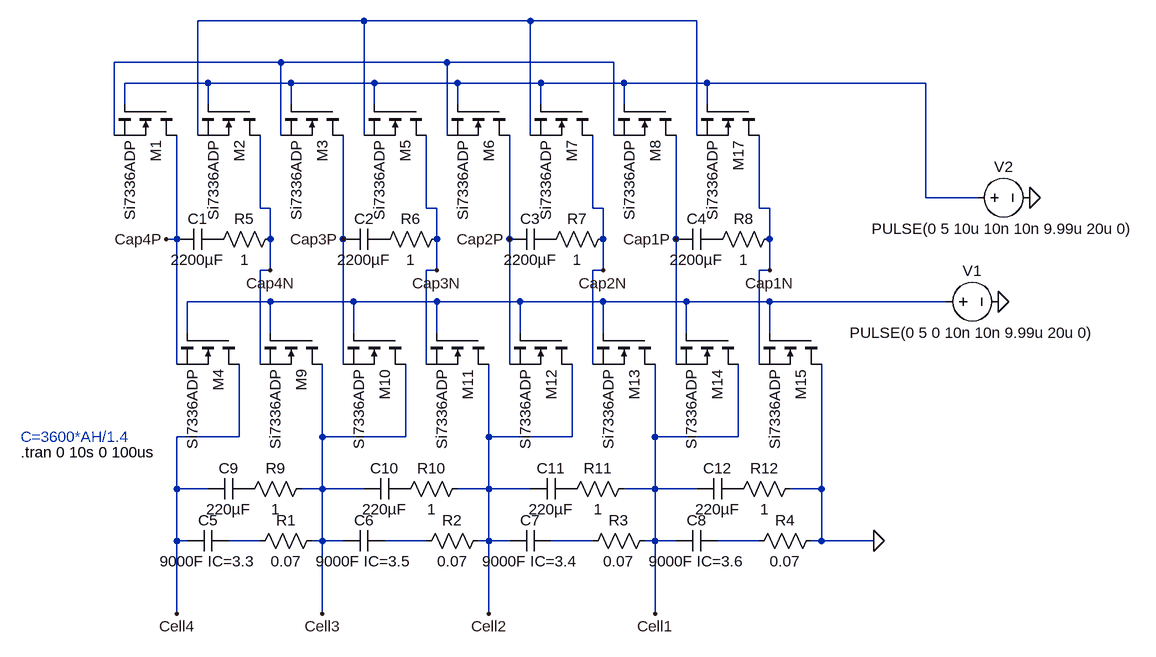
[diagram p0: schematic BMS.asc]
BMS.asc, the LTspice schematic file:
Version 4
SHEET 1 2364 904
WIRE 544 -112 288 -112
WIRE 800 -112 544 -112
WIRE 1056 -112 800 -112
WIRE 416 -48 160 -48
WIRE 672 -48 416 -48
WIRE 928 -48 672 -48
WIRE 304 -16 176 -16
WIRE 432 -16 304 -16
WIRE 560 -16 432 -16
WIRE 688 -16 560 -16
WIRE 816 -16 688 -16
WIRE 944 -16 816 -16
WIRE 1072 -16 944 -16
WIRE 1408 -16 1072 -16
WIRE 176 16 176 -16
WIRE 304 16 304 -16
WIRE 432 16 432 -16
WIRE 560 16 560 -16
WIRE 688 16 688 -16
WIRE 816 16 816 -16
WIRE 944 16 944 -16
WIRE 1072 16 1072 -16
WIRE 160 64 160 -48
WIRE 288 64 288 -112
WIRE 416 64 416 -48
WIRE 544 64 544 -112
WIRE 672 64 672 -48
WIRE 800 64 800 -112
WIRE 928 64 928 -48
WIRE 1056 64 1056 -112
WIRE 1408 160 1408 -16
WIRE 1488 160 1408 160
WIRE 384 176 384 64
WIRE 400 176 384 176
WIRE 640 176 640 64
WIRE 656 176 640 176
WIRE 896 176 896 64
WIRE 912 176 896 176
WIRE 1152 176 1152 64
WIRE 1168 176 1152 176
WIRE 256 224 256 64
WIRE 256 224 240 224
WIRE 400 224 400 176
WIRE 512 224 512 64
WIRE 656 224 656 176
WIRE 768 224 768 64
WIRE 912 224 912 176
WIRE 1024 224 1024 64
WIRE 1168 224 1168 176
WIRE 400 272 400 224
WIRE 400 272 384 272
WIRE 656 272 656 224
WIRE 656 272 640 272
WIRE 912 272 912 224
WIRE 912 272 896 272
WIRE 1168 272 1168 224
WIRE 1168 272 1152 272
WIRE 400 320 272 320
WIRE 528 320 400 320
WIRE 656 320 528 320
WIRE 784 320 656 320
WIRE 912 320 784 320
WIRE 1040 320 912 320
WIRE 1168 320 1040 320
WIRE 1440 320 1168 320
WIRE 272 368 272 320
WIRE 400 368 400 320
WIRE 528 368 528 320
WIRE 656 368 656 320
WIRE 784 368 784 320
WIRE 912 368 912 320
WIRE 1040 368 1040 320
WIRE 1168 368 1168 320
WIRE 256 416 256 224
WIRE 384 416 384 272
WIRE 512 416 512 224
WIRE 640 416 640 272
WIRE 768 416 768 224
WIRE 896 416 896 272
WIRE 1024 416 1024 224
WIRE 1152 416 1152 272
WIRE 352 528 352 416
WIRE 352 528 256 528
WIRE 480 528 480 416
WIRE 608 528 608 416
WIRE 608 528 480 528
WIRE 736 528 736 416
WIRE 864 528 864 416
WIRE 864 528 736 528
WIRE 992 528 992 416
WIRE 1120 528 1120 416
WIRE 1120 528 992 528
WIRE 256 608 256 528
WIRE 304 608 256 608
WIRE 480 608 480 528
WIRE 480 608 448 608
WIRE 544 608 480 608
WIRE 736 608 736 528
WIRE 736 608 688 608
WIRE 800 608 736 608
WIRE 992 608 992 528
WIRE 992 608 944 608
WIRE 1056 608 992 608
WIRE 1248 608 1248 416
WIRE 1248 608 1200 608
WIRE 256 688 256 608
WIRE 272 688 256 688
WIRE 384 688 336 688
WIRE 480 688 480 608
WIRE 480 688 464 688
WIRE 512 688 480 688
WIRE 640 688 576 688
WIRE 736 688 736 608
WIRE 736 688 720 688
WIRE 768 688 736 688
WIRE 896 688 832 688
WIRE 992 688 992 608
WIRE 992 688 976 688
WIRE 1024 688 992 688
WIRE 1152 688 1088 688
WIRE 1248 688 1248 608
WIRE 1248 688 1232 688
WIRE 1328 688 1248 688
WIRE 256 800 256 688
WIRE 480 800 480 688
WIRE 736 800 736 688
WIRE 992 800 992 688
FLAG 1568 160 0
FLAG 1520 320 0
FLAG 1328 688 0
FLAG 256 800 Cell4
FLAG 480 800 Cell3
FLAG 736 800 Cell2
FLAG 992 800 Cell1
FLAG 240 224 Cap4P
FLAG 400 272 Cap4N
FLAG 512 224 Cap3P
FLAG 656 272 Cap3N
FLAG 768 224 Cap2P
FLAG 1024 224 Cap1P
FLAG 912 272 Cap2N
FLAG 1168 272 Cap1N
SYMBOL nmos 256 16 R90
SYMATTR InstName M1
SYMATTR Value Si7336ADP
SYMBOL nmos 384 16 R90
SYMATTR InstName M2
SYMATTR Value Si7336ADP
SYMBOL nmos 512 16 R90
SYMATTR InstName M3
SYMATTR Value Si7336ADP
SYMBOL cap 256 208 M90
WINDOW 0 0 32 VBottom 2
WINDOW 3 32 32 VTop 2
SYMATTR InstName C1
SYMATTR Value 2200µF
SYMBOL cap 512 208 M90
WINDOW 0 0 32 VBottom 2
WINDOW 3 32 32 VTop 2
SYMATTR InstName C2
SYMATTR Value 2200µF
SYMBOL cap 768 208 M90
WINDOW 0 0 32 VBottom 2
WINDOW 3 32 32 VTop 2
SYMATTR InstName C3
SYMATTR Value 2200µF
SYMBOL cap 1024 208 M90
WINDOW 0 0 32 VBottom 2
WINDOW 3 32 32 VTop 2
SYMATTR InstName C4
SYMATTR Value 2200µF
SYMBOL cap 272 672 M90
WINDOW 0 0 32 VBottom 2
WINDOW 3 32 32 VTop 2
SYMATTR InstName C5
SYMATTR Value 9000F IC=3.3
SYMBOL res 480 672 R90
WINDOW 0 0 56 VBottom 2
WINDOW 3 32 56 VTop 2
SYMATTR InstName R1
SYMATTR Value 0.07
SYMBOL cap 512 704 R270
WINDOW 0 32 32 VTop 2
WINDOW 3 0 32 VBottom 2
SYMATTR InstName C6
SYMATTR Value 9000F IC=3.5
SYMBOL res 736 672 R90
WINDOW 0 0 56 VBottom 2
WINDOW 3 32 56 VTop 2
SYMATTR InstName R2
SYMATTR Value 0.07
SYMBOL cap 768 672 M90
WINDOW 0 0 32 VBottom 2
WINDOW 3 32 32 VTop 2
SYMATTR InstName C7
SYMATTR Value 9000F IC=3.4
SYMBOL res 992 672 R90
WINDOW 0 0 56 VBottom 2
WINDOW 3 32 56 VTop 2
SYMATTR InstName R3
SYMATTR Value 0.07
SYMBOL cap 1024 672 M90
WINDOW 0 0 32 VBottom 2
WINDOW 3 32 32 VTop 2
SYMATTR InstName C8
SYMATTR Value 9000F IC=3.6
SYMBOL res 1248 672 R90
WINDOW 0 0 56 VBottom 2
WINDOW 3 32 56 VTop 2
SYMATTR InstName R4
SYMATTR Value 0.07
SYMBOL voltage 1424 320 R270
WINDOW 0 32 56 VTop 2
WINDOW 3 -32 56 VBottom 2
WINDOW 123 0 0 Left 0
WINDOW 39 0 0 Left 0
SYMATTR InstName V1
SYMATTR Value PULSE(0 5 0 10n 10n 9.99u 20u 0)
SYMBOL voltage 1472 160 R270
WINDOW 0 32 56 VTop 2
WINDOW 3 -32 56 VBottom 2
WINDOW 123 0 0 Left 0
WINDOW 39 0 0 Left 0
SYMATTR InstName V2
SYMATTR Value PULSE(0 5 10u 10n 10n 9.99u 20u 0)
SYMBOL res 416 208 R90
WINDOW 0 0 56 VBottom 2
WINDOW 3 32 56 VTop 2
SYMATTR InstName R5
SYMATTR Value 1
SYMBOL res 672 208 R90
WINDOW 0 0 56 VBottom 2
WINDOW 3 32 56 VTop 2
SYMATTR InstName R6
SYMATTR Value 1
SYMBOL res 928 208 R90
WINDOW 0 0 56 VBottom 2
WINDOW 3 32 56 VTop 2
SYMATTR InstName R7
SYMATTR Value 1
SYMBOL res 1184 208 R90
WINDOW 0 0 56 VBottom 2
WINDOW 3 32 56 VTop 2
SYMATTR InstName R8
SYMATTR Value 1
SYMBOL nmos 640 16 R90
SYMATTR InstName M5
SYMATTR Value Si7336ADP
SYMBOL nmos 768 16 R90
SYMATTR InstName M6
SYMATTR Value Si7336ADP
SYMBOL nmos 896 16 R90
SYMATTR InstName M7
SYMATTR Value Si7336ADP
SYMBOL nmos 1024 16 R90
SYMATTR InstName M8
SYMATTR Value Si7336ADP
SYMBOL nmos 1152 16 R90
SYMATTR InstName M17
SYMATTR Value Si7336ADP
SYMBOL nmos 352 368 R90
SYMATTR InstName M4
SYMATTR Value Si7336ADP
SYMBOL nmos 480 368 R90
SYMATTR InstName M9
SYMATTR Value Si7336ADP
SYMBOL nmos 608 368 R90
SYMATTR InstName M10
SYMATTR Value Si7336ADP
SYMBOL nmos 736 368 R90
SYMATTR InstName M11
SYMATTR Value Si7336ADP
SYMBOL nmos 864 368 R90
SYMATTR InstName M12
SYMATTR Value Si7336ADP
SYMBOL nmos 992 368 R90
SYMATTR InstName M13
SYMATTR Value Si7336ADP
SYMBOL nmos 1120 368 R90
SYMATTR InstName M14
SYMATTR Value Si7336ADP
SYMBOL nmos 1248 368 R90
SYMATTR InstName M15
SYMATTR Value Si7336ADP
SYMBOL cap 304 592 M90
WINDOW 0 0 32 VBottom 2
WINDOW 3 32 32 VTop 2
SYMATTR InstName C9
SYMATTR Value 220µF
SYMBOL res 464 592 R90
WINDOW 0 0 56 VBottom 2
WINDOW 3 32 56 VTop 2
SYMATTR InstName R9
SYMATTR Value 1
SYMBOL cap 544 592 M90
WINDOW 0 0 32 VBottom 2
WINDOW 3 32 32 VTop 2
SYMATTR InstName C10
SYMATTR Value 220µF
SYMBOL res 704 592 R90
WINDOW 0 0 56 VBottom 2
WINDOW 3 32 56 VTop 2
SYMATTR InstName R10
SYMATTR Value 1
SYMBOL cap 800 592 M90
WINDOW 0 0 32 VBottom 2
WINDOW 3 32 32 VTop 2
SYMATTR InstName C11
SYMATTR Value 220µF
SYMBOL res 960 592 R90
WINDOW 0 0 56 VBottom 2
WINDOW 3 32 56 VTop 2
SYMATTR InstName R11
SYMATTR Value 1
SYMBOL cap 1056 592 M90
WINDOW 0 0 32 VBottom 2
WINDOW 3 32 32 VTop 2
SYMATTR InstName C12
SYMATTR Value 220µF
SYMBOL res 1216 592 R90
WINDOW 0 0 56 VBottom 2
WINDOW 3 32 56 VTop 2
SYMATTR InstName R12
SYMATTR Value 1
TEXT 16 528 Left 2 ;C=3600*AH/1.4
TEXT 16 552 Left 2 !.tran 0 10s 0 100us

The netlist it stands for:
* BMS.asc
M1 Cap4P N003 N002 N002 Si7336ADP
M2 Cap4N N003 N001 N001 Si7336ADP
M3 Cap3P N003 N002 N002 Si7336ADP
C1 Cap4P P001 2200µF
C2 Cap3P P002 2200µF
C3 Cap2P P003 2200µF
C4 Cap1P P004 2200µF
C5 Cell4 N005 9000F IC=3.3
R1 Cell3 N005 0.07
C6 Cell3 N006 9000F IC=3.5
R2 Cell2 N006 0.07
C7 Cell2 N007 9000F IC=3.4
R3 Cell1 N007 0.07
C8 Cell1 N008 9000F IC=3.6
R4 0 N008 0.07
V1 N004 0 PULSE(0 5 0 10n 10n 9.99u 20u 0)
V2 N003 0 PULSE(0 5 10u 10n 10n 9.99u 20u 0)
R5 Cap4N P001 1
R6 Cap3N P002 1
R7 Cap2N P003 1
R8 Cap1N P004 1
M5 Cap3N N003 N001 N001 Si7336ADP
M6 Cap2P N003 N002 N002 Si7336ADP
M7 Cap2N N003 N001 N001 Si7336ADP
M8 Cap1P N003 N002 N002 Si7336ADP
M17 Cap1N N003 N001 N001 Si7336ADP
M4 Cell4 N004 Cap4P Cap4P Si7336ADP
M9 Cell3 N004 Cap4N Cap4N Si7336ADP
M10 Cell3 N004 Cap3P Cap3P Si7336ADP
M11 Cell2 N004 Cap3N Cap3N Si7336ADP
M12 Cell2 N004 Cap2P Cap2P Si7336ADP
M13 Cell1 N004 Cap2N Cap2N Si7336ADP
M14 Cell1 N004 Cap1P Cap1P Si7336ADP
M15 0 N004 Cap1N Cap1N Si7336ADP
C9 Cell4 P005 220µF
R9 Cell3 P005 1
C10 Cell3 P006 220µF
R10 Cell2 P006 1
C11 Cell2 P007 220µF
R11 Cell1 P007 1
C12 Cell1 P008 220µF
R12 0 P008 1
.model NMOS NMOS
.model PMOS PMOS
.lib standard.mos
* C=3600*AH/1.4
.tran 0 10s 0 100us
.backanno
.end